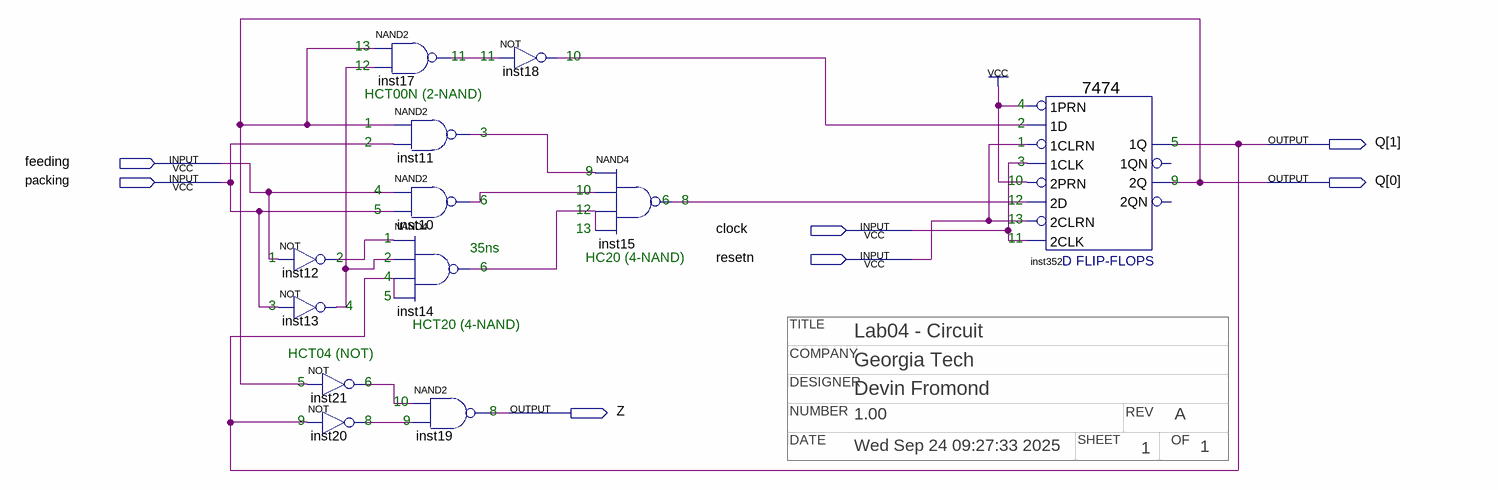
[diagram p0: schematic sheet]
// Quartus schematic Lab04_KMAP.bdf as structural Verilog: 12 symbols, 7 pins
// Title block: COMPANY: Georgia Tech; DATE: Wed Sep 24 09:27:33 2025; DESIGNER: Devin Fromond; NUMBER: 1.00; OF: 1; REV: A; SHEET: 1; TITLE: Lab04 - Circuit
module Lab04_KMAP (
  input  feeding,
  input  packing,
  input  clock,
  input  resetn,
  output [1:0] Q,
  output Z
);

  wire inst10_out, inst11_out, inst12_out, inst13_out, inst14_out, inst15_out, inst17_out, inst18_out,
       inst20_out, inst21_out;

  not inst12 (inst12_out, feeding);
  not inst13 (inst13_out, packing);
  not inst21 (inst21_out, Q[0]);
  not inst20 (inst20_out, Q[1]);
  nand inst17 (inst17_out, Q[0], inst13_out);
  nand inst11 (inst11_out, Q[0], packing);
  nand inst10 (inst10_out, feeding, packing);
  nand inst14 (inst14_out, inst12_out, inst13_out, Q[1], Q[1]);
  nand inst19 (Z, inst21_out, inst20_out);
  not inst18 (inst18_out, inst17_out);
  nand inst15 (inst15_out, inst11_out, inst10_out, inst14_out, inst14_out);
  \7474  inst352 (
    .\2D (inst15_out), .\2PRN (1'b1), .\1CLK (clock), .\1D (inst18_out), .\1PRN (1'b1), .\2CLK (clock),
    .\2CLRN (resetn), .\1CLRN (resetn), .\2Q (Q[0]), .\1Q (Q[1]));  // open: 1QN, 2QN

  // Notes on the sheet:
  //   13
  //   11
  //   11
  //   10
  //   12
  //   HCT00N (2-NAND)
  //   4
  //   1
  //   2
  //   3
  //   2
  //   1
  //   5
  //   3
  //   9
  //   10
  //   9
  //   4
  //   10
  //   6
  //   6
  //   8
  //   12
  //   5
  //   12
  //   13
  //   13
  //   1
  //   11
  //   35ns
  //   1
  //   2
  //   2
  //   HC20 (4-NAND)
  //   6
  //   4
  //   5
  //   3
  //   4
  //   HCT20 (4-NAND)
  //   HCT04 (NOT)
  //   5
  //   6
  //   10
  //   8
  //   9
  //   8
  //   9
endmodule
